# Altium project xxxxxx_PCB_Spectrum_Analyzer_x.PrjPcb
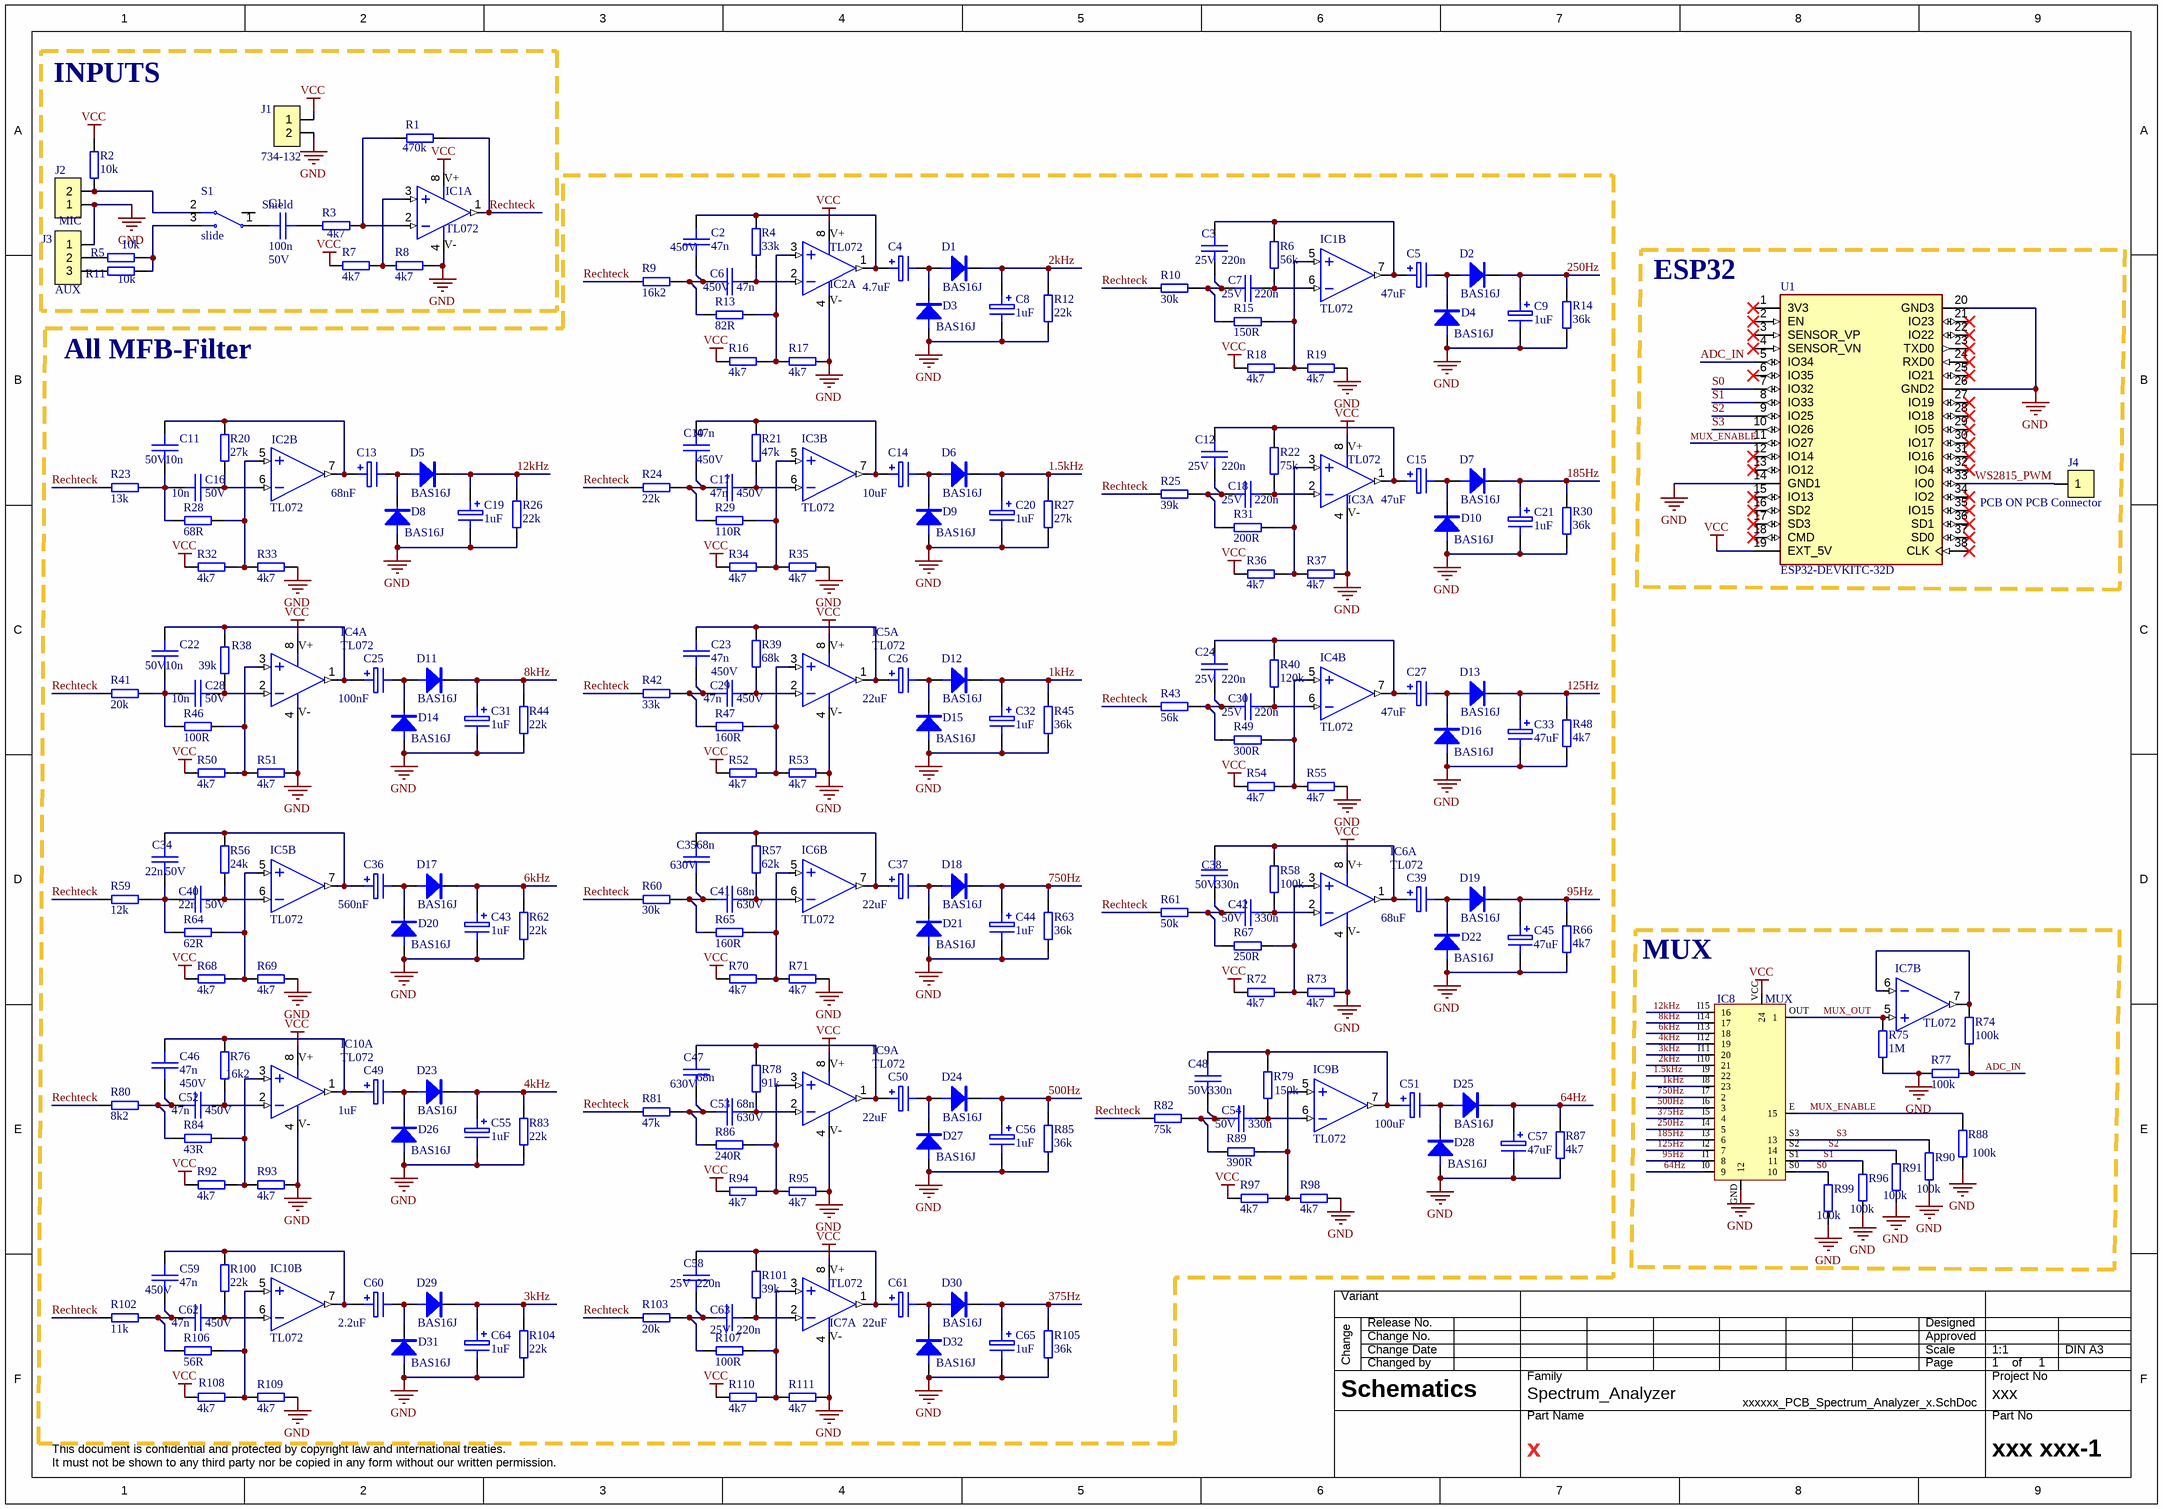
[diagram p0: xxxxxx_PCB_Spectrum_Analyzer_x.SchDoc]
a01PartNr1: xxx; a02PartNr2: xxx; a03Version: 1; a04Family: Spectrum_Analyzer; a05PartName: x; a06ProjectNumber: xxx; d01PanelTolerance: +/-0.100 mm; d02MaskMaterial: CrNi-Steel; d03MaskThickness: 100 um; d04MaskReduction: 10%; d05MaskTreatment: electro polished; d06FileName: xxxxxx_PCB_Spectrum_Analyzer_x; d07PanelName: xxxxxx_PCB_Spectrum_Analyzer_x_Panel; d08ThicknessTolerance: +/-10%
1 sheet, 224 parts. Net scope: global (net labels, ports and power ports of the same name join across sheets).
Board files: xxxxxx_PCB_Spectrum_Analyzer_x.PcbDoc, xxxxxx_PCB_Spectrum_Analyzer_x_Panel.PcbDoc

## Sheet xxxxxx_PCB_Spectrum_Analyzer_x.SchDoc
size 405 x 281 mm; SheetNumber: 1; SheetTotal: 1; CompanyName: CEDES AG

### Parts
C1  100n  U: 50V  [C_0805_B]
C2  47n  U: 450V  [C_0805_C]
C3  220n  U: 25V  [C_1206_C]
C4  4.7uF  [C 4.7uF]
C5  47uF  [C 4.7uF]
C6  47n  U: 450V  [C_0805_C]
C7  220n  U: 25V  [C_1206_C]
C8  1uF  [C 4.7uF]
C9  1uF  [C 4.7uF]
C10  47n  U: 450V  [C_0805_C]
C11  10n  U: 50V  [C_0805_B]
C12  220n  U: 25V  [C_1206_C]
C13  68nF  [C 4.7uF]
C14  10uF  [C 4.7uF]
C15  47uF  [C 4.7uF]
C16  10n  U: 50V  [C_0805_B]
C17  47n  U: 450V  [C_0805_C]
C18  220n  U: 25V  [C_1206_C]
C19  1uF  [C 4.7uF]
C20  1uF  [C 4.7uF]
C21  1uF  [C 4.7uF]
C22  10n  U: 50V  [C_0805_B]
C23  47n  U: 450V  [C_0805_C]
C24  220n  U: 25V  [C_1206_C]
C25  100nF  [C 4.7uF]
C26  22uF  [C 4.7uF]
C27  47uF  [C 4.7uF]
C28  10n  U: 50V  [C_0805_B]
C29  47n  U: 450V  [C_0805_C]
C30  220n  U: 25V  [C_1206_C]
C31  1uF  [C 4.7uF]
C32  1uF  [C 4.7uF]
C33  47uF  [C 4.7uF]
C34  22n  U: 50V  [C_0805_A]
C35  68n  U: 630V  [C_1210_D]
C36  560nF  [C 4.7uF]
C37  22uF  [C 4.7uF]
C38  330n  U: 50V  [C_1210_D]
C39  68uF  [C 4.7uF]
C40  22n  U: 50V  [C_0805_A]
C41  68n  U: 630V  [C_1210_D]
C42  330n  U: 50V  [C_1210_D]
C43  1uF  [C 4.7uF]
C44  1uF  [C 4.7uF]
C45  47uF  [C 4.7uF]
C46  47n  U: 450V  [C_0805_C]
C47  68n  U: 630V  [C_1210_D]
C48  330n  U: 50V  [C_1210_D]
C49  1uF  [C 4.7uF]
C50  22uF  [C 4.7uF]
C51  100uF  [C 4.7uF]
C52  47n  U: 450V  [C_0805_C]
C53  68n  U: 630V  [C_1210_D]
C54  330n  U: 50V  [C_1210_D]
C55  1uF  [C 4.7uF]
C56  1uF  [C 4.7uF]
C57  47uF  [C 4.7uF]
C58  220n  U: 25V  [C_1206_C]
C59  47n  U: 450V  [C_0805_C]
C60  2.2uF  [C 4.7uF]
C61  22uF  [C 4.7uF]
C62  47n  U: 450V  [C_0805_C]
C63  220n  U: 25V  [C_1206_C]
C64  1uF  [C 4.7uF]
C65  1uF  [C 4.7uF]
D1  Part: BAS16J  [SOD323F]
D2  Part: BAS16J  [SOD323F]
D3  Part: BAS16J  [SOD323F]
D4  Part: BAS16J  [SOD323F]
D5  Part: BAS16J  [SOD323F]
D6  Part: BAS16J  [SOD323F]
D7  Part: BAS16J  [SOD323F]
D8  Part: BAS16J  [SOD323F]
D9  Part: BAS16J  [SOD323F]
D10  Part: BAS16J  [SOD323F]
D11  Part: BAS16J  [SOD323F]
D12  Part: BAS16J  [SOD323F]
D13  Part: BAS16J  [SOD323F]
D14  Part: BAS16J  [SOD323F]
D15  Part: BAS16J  [SOD323F]
D16  Part: BAS16J  [SOD323F]
D17  Part: BAS16J  [SOD323F]
D18  Part: BAS16J  [SOD323F]
D19  Part: BAS16J  [SOD323F]
D20  Part: BAS16J  [SOD323F]
D21  Part: BAS16J  [SOD323F]
D22  Part: BAS16J  [SOD323F]
D23  Part: BAS16J  [SOD323F]
D24  Part: BAS16J  [SOD323F]
D25  Part: BAS16J  [SOD323F]
D26  Part: BAS16J  [SOD323F]
D27  Part: BAS16J  [SOD323F]
D28  Part: BAS16J  [SOD323F]
D29  Part: BAS16J  [SOD323F]
D30  Part: BAS16J  [SOD323F]
D31  Part: BAS16J  [SOD323F]
D32  Part: BAS16J  [SOD323F]
IC1  TL072  [SO8_A]  (parts A,B of 2)
IC2  TL072  [SO8_A]  (parts A,B of 2)
IC3  TL072  [SO8_A]  (parts A,B of 2)
IC4  TL072  [SO8_A]  (parts A,B of 2)
IC5  TL072  [SO8_A]  (parts A,B of 2)
IC6  TL072  [SO8_A]  (parts A,B of 2)
IC7  TL072  [SO8_A]  (parts A,B of 2)
IC8  MUX  [MUX]
IC9  TL072  [SO8_A]  (parts A,B of 2)
IC10  TL072  [SO8_A]  (parts A,B of 2)
J1  734-132  [734-132]
J2  MIC  [734-132]
J3  AUX  [734-133]
J4  PCB ON PCB Connector  [PCBConnectorPad]
R1  470k  [R_0805_A]
R2  10k  [R_0805_A]
R3  4k7  [R_0805_A]
R4  33k  [R_0805_A]
R5  10k  [R_0805_A]
R6  56k  [R_0805_A]
R7  4k7  [R_0805_A]
R8  4k7  [R_0805_A]
R9  16k2  [R_0805_A]
R10  30k  [R_0805_A]
R11  10k  [R_0805_A]
R12  22k  [R_0805_A]
R13  82R  [R_0805_A]
R14  36k  [R_0805_A]
R15  150R  [R_0805_A]
R16  4k7  [R_0805_A]
R17  4k7  [R_0805_A]
R18  4k7  [R_0805_A]
R19  4k7  [R_0805_A]
R20  27k  [R_0805_A]
R21  47k  [R_0805_A]
R22  75k  [R_0805_A]
R23  13k  [R_0402_A]
R24  22k  [R_0805_A]
R25  39k  [R_0805_A]
R26  22k  [R_0805_A]
R27  27k  [R_0805_A]
R28  68R  [R_0805_A]
R29  110R  [R_0805_A]
R30  36k  [R_0805_A]
R31  200R  [R_0805_A]
R32  4k7  [R_0805_A]
R33  4k7  [R_0805_A]
R34  4k7  [R_0805_A]
R35  4k7  [R_0805_A]
R36  4k7  [R_0805_A]
R37  4k7  [R_0805_A]
R38  39k  [R_0805_A]
R39  68k  [R_0805_A]
R40  120k  [R_0805_A]
R41  20k  [R_0805_A]
R42  33k  [R_0805_A]
R43  56k  [R_0805_A]
R44  22k  [R_0805_A]
R45  36k  [R_0805_A]
R46  100R  [R_0805_A]
R47  160R  [R_0805_A]
R48  4k7  [R_0805_A]
R49  300R  [R_0805_A]
R50  4k7  [R_0805_A]
R51  4k7  [R_0805_A]
R52  4k7  [R_0805_A]
R53  4k7  [R_0805_A]
R54  4k7  [R_0805_A]
R55  4k7  [R_0805_A]
R56  24k  [R_0805_A]
R57  62k  [R_0805_A]
R58  100k  [R_0805_A]
R59  12k  [R_0805_A]
R60  30k  [R_0805_A]
R61  50k  [R_0805_A]
R62  22k  [R_0805_A]
R63  36k  [R_0805_A]
R64  62R  [R_0805_A]
R65  160R  [R_0805_A]
R66  4k7  [R_0805_A]
R67  250R  [R_0805_A]
R68  4k7  [R_0805_A]
R69  4k7  [R_0805_A]
R70  4k7  [R_0805_A]
R71  4k7  [R_0805_A]
R72  4k7  [R_0805_A]
R73  4k7  [R_0805_A]
R74  100k  [R_0805_A]
R75  1M  [R_0805_A]
R76  16k2  [R_0805_A]
R77  100k  [R_0805_A]
R78  91k  [R_0805_A]
R79  150k  [R_0805_A]
R80  8k2  [R_0805_A]
R81  47k  [R_0805_A]
R82  75k  [R_0805_A]
R83  22k  [R_0805_A]
R84  43R  [R_0805_A]
R85  36k  [R_0805_A]
R86  240R  [R_0805_A]
R87  4k7  [R_0805_A]
R88  100k  [R_0805_A]
R89  390R  [R_0805_A]
R90  100k  [R_0805_A]
R91  100k  [R_0805_A]
R92  4k7  [R_0805_A]
R93  4k7  [R_0805_A]
R94  4k7  [R_0805_A]
R95  4k7  [R_0805_A]
R96  100k  [R_0805_A]
R97  4k7  [R_0805_A]
R98  4k7  [R_0805_A]
R99  100k  [R_0805_A]
R100  22k  [R_0805_A]
R101  39k  [R_0805_A]
R102  11k  [R_0805_A]
R103  20k  [R_0805_A]
R104  22k  [R_0805_A]
R105  36k  [R_0805_A]
R106  56R  [R_0805_A]
R107  100R  [R_0805_A]
R108  4k7  [R_0805_A]
R109  4k7  [R_0805_A]
R110  4k7  [R_0805_A]
R111  4k7  [R_0805_A]
S1  slide  [MSS3]
U1  ESP32-DEVKITC-32D  [MODULE_ESP32-DEVKITC-32D]

### Blocks framed on the sheet
INPUTS: C1 IC1 J1-J3 R1-R3 R5 R7 R8 R11 S1
All MFB-Filter: C2-C65 D1-D32 IC1-IC7 IC9 IC10 R4 R6 R9 R10 R12-R73 R76 R78-R87 R89 R92-R95 R97 R98 R100-R111
ESP32: J4 U1
MUX: IC7 IC8 R74 R75 R77 R88 R90 R91 R96 R99

### Nets
GND: C8.2 C9.2 C19.2 C20.2 C21.2 C31.2 C32.2 C33.2 C43.2 C44.2 C45.2 C55.2 C56.2 C57.2 C64.2 C65.2 D3.2(A) D4.2(A) D8.2(A) D9.2(A) D10.2(A) D14.2(A) D15.2(A) D16.2(A) D20.2(A) D21.2(A) D22.2(A) D26.2(A) D27.2(A) D28.2(A) D31.2(A) D32.2(A) IC1.4(V-) IC2.4(V-) IC3.4(V-) IC4.4(V-) IC5.4(V-) IC6.4(V-) IC7.4(V-) IC8.GND(12) IC9.4(V-) IC10.4(V-) J1.2 J2.1 J3.1 R8.2 R12.1 R14.1 R17.2 R19.2 R26.1 R27.1 R30.1 R33.2 R35.2 R37.2 R44.1 R45.1 R48.1 R51.2 R53.2 R55.2 R62.1 R63.1 R66.1 R69.2 R71.2 R73.2 R75.2 R77.2 R83.1 R85.1 R87.1 R88.1 R90.1 R91.1 R93.2 R95.2 R96.1 R98.2 R99.1 R104.1 R105.1 R109.2 R111.2 U1.14(GND1) U1.20(GND3) U1.26(GND2)
VCC: IC1.8(V+) IC2.8(V+) IC3.8(V+) IC4.8(V+) IC5.8(V+) IC6.8(V+) IC7.8(V+) IC8.VCC(24) IC9.8(V+) IC10.8(V+) J1.1 R2.2 R7.1 R16.1 R18.1 R32.1 R34.1 R36.1 R50.1 R52.1 R54.1 R68.1 R70.1 R72.1 R92.1 R94.1 R97.1 R108.1 R110.1 U1.19(EXT_5V)
1.5kHz: C20.1 D6.1(K) IC8.I9(22) R27.2
1kHz: C32.1 D12.1(K) IC8.I8(23) R45.2
2kHz: C8.1 D1.1(K) IC8.I10(21) R12.2
3kHz: C64.1 D29.1(K) IC8.I11(20) R104.2
4kHz: C55.1 D23.1(K) IC8.I12(19) R83.2
6kHz: C43.1 D17.1(K) IC8.I13(18) R62.2
8kHz: C31.1 D11.1(K) IC8.I14(17) R44.2
12kHz: C19.1 D5.1(K) IC8.I15(16) R26.2
64Hz: C57.1 D25.1(K) IC8.I0(9) R87.2
95Hz: C45.1 D19.1(K) IC8.I1(8) R66.2
125Hz: C33.1 D13.1(K) IC8.I2(7) R48.2
185Hz: C21.1 D7.1(K) IC8.I3(6) R30.2
250Hz: C9.1 D2.1(K) IC8.I4(5) R14.2
375Hz: C65.1 D30.1(K) IC8.I5(4) R105.2
500Hz: C56.1 D24.1(K) IC8.I6(3) R85.2
750Hz: C44.1 D18.1(K) IC8.I7(2) R63.2
ADC_IN: R74.2 R77.1 U1.5(IO34)
MUX_ENABLE: IC8.E(15) R88.2 U1.11(IO27)
MUX_OUT: IC7.5(B+) IC8.OUT(1) R75.1
Rechteck: IC1.1(Aout) R1.2 R9.2 R10.1 R23.2 R24.1 R25.1 R41.1 R42.1 R43.1 R59.1 R60.1 R61.1 R80.1 R81.1 R82.1 R102.1 R103.1
S0: IC8.S0(10) R99.2 U1.7(IO32)
S1: IC8.S1(11) R96.2 U1.8(IO33)
S2: IC8.S2(14) R91.2 U1.9(IO25)
S3: IC8.S3(13) R90.2 U1.10(IO26)
WS2815_PWM: J4.1 U1.33(IO0)
NetC1_1: C1.1 S1.1(A)
NetC1_2: C1.2 R3.1
NetC2_1: C2.1 C6.1 R9.1 R13.2
NetC2_2: C2.2 C4.1 IC2.1(Aout) R4.2
NetC3_1: C3.1 C7.1 R10.2 R15.1
NetC3_2: C3.2 C5.1 IC1.7(Bout) R6.2
NetC4_2: C4.2 D1.2(A) D3.1(K)
NetC5_2: C5.2 D2.2(A) D4.1(K)
NetC6_2: C6.2 IC2.2(A-) R4.1
NetC7_2: C7.2 IC1.6(B-) R6.1
NetC10_1: C10.1 C17.1 R24.2 R29.1
NetC10_2: C10.2 C14.1 IC3.7(Bout) R21.2
NetC11_1: C11.1 C16.1 R23.1 R28.1
NetC11_2: C11.2 C13.1 IC2.7(Bout) R20.2
NetC12_1: C12.1 C18.1 R25.2 R31.1
NetC12_2: C12.2 C15.1 IC3.1(Aout) R22.2
NetC13_2: C13.2 D5.2(A) D8.1(K)
NetC14_2: C14.2 D6.2(A) D9.1(K)
NetC15_2: C15.2 D7.2(A) D10.1(K)
NetC16_2: C16.2 IC2.6(B-) R20.1
NetC17_2: C17.2 IC3.6(B-) R21.1
NetC18_2: C18.2 IC3.2(A-) R22.1
NetC22_1: C22.1 C28.1 R41.2 R46.1
NetC22_2: C22.2 C25.1 IC4.1(Aout) R38.1
NetC23_1: C23.1 C29.1 R42.2 R47.1
NetC23_2: C23.2 C26.1 IC5.1(Aout) R39.2
NetC24_1: C24.1 C30.1 R43.2 R49.1
NetC24_2: C24.2 C27.1 IC4.7(Bout) R40.2
NetC25_2: C25.2 D11.2(A) D14.1(K)
NetC26_2: C26.2 D12.2(A) D15.1(K)
NetC27_2: C27.2 D13.2(A) D16.1(K)
NetC28_2: C28.2 IC4.2(A-) R38.2
NetC29_2: C29.2 IC5.2(A-) R39.1
NetC30_2: C30.2 IC4.6(B-) R40.1
NetC34_1: C34.1 C40.1 R59.2 R64.1
NetC34_2: C34.2 C36.1 IC5.7(Bout) R56.2
NetC35_1: C35.1 C41.1 R60.2 R65.1
NetC35_2: C35.2 C37.1 IC6.7(Bout) R57.2
NetC36_2: C36.2 D17.2(A) D20.1(K)
NetC37_2: C37.2 D18.2(A) D21.1(K)
NetC38_1: C38.1 C42.1 R61.2 R67.1
NetC38_2: C38.2 C39.1 IC6.1(Aout) R58.2
NetC39_2: C39.2 D19.2(A) D22.1(K)
NetC40_2: C40.2 IC5.6(B-) R56.1
NetC41_2: C41.2 IC6.6(B-) R57.1
NetC42_2: C42.2 IC6.2(A-) R58.1
NetC46_1: C46.1 C52.1 R80.2 R84.1
NetC46_2: C46.2 C49.1 IC10.1(Aout) R76.2
NetC47_1: C47.1 C53.1 R81.2 R86.1
NetC47_2: C47.2 C50.1 IC9.1(Aout) R78.2
NetC48_1: C48.1 C54.1 R82.2 R89.1
NetC48_2: C48.2 C51.1 IC9.7(Bout) R79.2
NetC49_2: C49.2 D23.2(A) D26.1(K)
NetC50_2: C50.2 D24.2(A) D27.1(K)
NetC51_2: C51.2 D25.2(A) D28.1(K)
NetC52_2: C52.2 IC10.2(A-) R76.1
NetC53_2: C53.2 IC9.2(A-) R78.1
NetC54_2: C54.2 IC9.6(B-) R79.1
NetC58_1: C58.1 C63.1 R103.2 R107.1
NetC58_2: C58.2 C61.1 IC7.1(Aout) R101.2
NetC59_1: C59.1 C62.1 R102.2 R106.1
NetC59_2: C59.2 C60.1 IC10.7(Bout) R100.2
NetC60_2: C60.2 D29.2(A) D31.1(K)
NetC61_2: C61.2 D30.2(A) D32.1(K)
NetC62_2: C62.2 IC10.6(B-) R100.1
NetC63_2: C63.2 IC7.2(A-) R101.1
NetIC1_2: IC1.2(A-) R1.1 R3.2
NetIC1_3: IC1.3(A+) R7.2 R8.1
NetIC1_5: IC1.5(B+) R15.2 R18.2 R19.1
NetIC2_3: IC2.3(A+) R13.1 R16.2 R17.1
NetIC2_5: IC2.5(B+) R28.2 R32.2 R33.1
NetIC3_3: IC3.3(A+) R31.2 R36.2 R37.1
NetIC3_5: IC3.5(B+) R29.2 R34.2 R35.1
NetIC4_3: IC4.3(A+) R46.2 R50.2 R51.1
NetIC4_5: IC4.5(B+) R49.2 R54.2 R55.1
NetIC5_3: IC5.3(A+) R47.2 R52.2 R53.1
NetIC5_5: IC5.5(B+) R64.2 R68.2 R69.1
NetIC6_3: IC6.3(A+) R67.2 R72.2 R73.1
NetIC6_5: IC6.5(B+) R65.2 R70.2 R71.1
NetIC7_3: IC7.3(A+) R107.2 R110.2 R111.1
NetIC7_6: IC7.6(B-) IC7.7(Bout) R74.1
NetIC9_3: IC9.3(A+) R86.2 R94.2 R95.1
NetIC9_5: IC9.5(B+) R89.2 R97.2 R98.1
NetIC10_3: IC10.3(A+) R84.2 R92.2 R93.1
NetIC10_5: IC10.5(B+) R106.2 R108.2 R109.1
NetJ2_2: J2.2 R2.1 S1.2(C)
NetJ3_2: J3.2 R5.2
NetJ3_3: J3.3 R11.2
NetR5_1: R5.1 R11.1 S1.3(A)

Not connected (* = marked no-connect by the designer): S1 Shield; U1 1(3V3)* 2(EN)* 3(SENSOR_VP)* 4(SENSOR_VN)* 6(IO35)* 12(IO14)* 13(IO12)* 15(IO13)* 16(SD2)* 17(SD3)* 18(CMD)* 21(IO23)* 22(IO22)* 23(TXD0)* 24(RXD0)* 25(IO21)* 27(IO19)* 28(IO18)* 29(IO5)* 30(IO17)* 31(IO16)* 32(IO4)* 34(IO2)* 35(IO15)* 36(SD1)* 37(SD0)* 38(CLK)*

### Notes on the sheet
- Variant
- Release No.
- Designed
- Change
- Change No.
- Changed by
- Change Date
- Family
- Approved
- Page
- Scale
- 1:1
- Project No
- of
- DIN A3
- This document is confidential and protected by copyright law and international treaties.
- Schematics
- Part Name
- Part No
- It must not be shown to any third party nor be copied in any form without our written permission.

### Library data of the parts
C1 = 301 143: C 100n 10% 50V X7R 0805; Part Number: 301 143; %: 10; Signal Integrity: Cap; Imax: x; C2: 1; C3: 4; Ea1: 0.35; Tref: 40; State: active; Assembly: SMD; UrefUmax: 0.5; VALUE: 100n; Umax: 50V; Component Type: Capacitor; ComponentLink1Description: Datasheet; ComponentLink1URL: \\vm-pizol\DATEN\Fabdaten\3xx xxx\30x xxx\301 xxx\301 1xx\301143_C_100nF_10%_50V_X7R_0805; Footprint: 0805; Pin Count: 2; Published: 08.01.2016; Publisher: RKE; Ieff: x; Ueff: *; Teff: *; C1: x; A: 1; Ea2: x; Failure rate: 2; Cost: 0.007200; Pmax: x; IrefImax: x
C2 C6 C10 C17 C23 C29 C46 C52 C59 C62 = 302 687: C 47n 10% 450V X7T 0805; Part Number: 302 687; %: 10; Signal Integrity: Cap; Imax: x; C2: 1; C3: 4; Ea1: 0.35; Tref: 40; State: active; Assembly: SMD; UrefUmax: 0.5; VALUE: 47n; Umax: 450V; Component Type: Capacitor; ComponentLink1Description: Datasheet; ComponentLink1URL: \\vm-pizol\DATEN\Fabdaten\3xx xxx\30x xxx\302 xxx\302 6xx\302687; Footprint: 0805; Pin Count: 2; Published: 08.01.2016; Publisher: RKE; Ieff: x; Ueff: *; Teff: *; C1: x; A: 1; Ea2: x; Failure rate: 2; Cost: 0.058200; Pmax: x; IrefImax: x
C3 C7 C12 C18 C24 C30 C58 C63 = 301 734: C 220n 20% 25V X7R 1206; Part Number: 301 734; %: 20; Signal Integrity: Cap; Imax: x; C2: 1; C3: 4; Ea1: 0.35; Tref: 40; State: active; Assembly: SMD; UrefUmax: 0.5; VALUE: 220n; Umax: 25V; Component Type: Capacitor; ComponentLink1Description: Datasheet; ComponentLink1URL: \\vm-pizol\DATEN\Fabdaten\3xx xxx\30x xxx\301 xxx\301 7xx\301734_C_220nF_20%_25V_X7R_1206; Footprint: 1206; Pin Count: 2; Published: 08.01.2016; Publisher: RKE; Ieff: x; Ueff: *; Teff: *; C1: x; A: 1; Ea2: x; Failure rate: 2; Cost: 0.009500; Pmax: x; IrefImax: x
C4 C5 C8 C9 C13-C15 C19-C21 C25-C27 C31-C33 C36 C37 C39 C43-C45 C49-C51 C55-C57 C60 C61 C64 C65 = C 4.7uF 450V
C11 C16 C22 C28 = 300 130: C 10n 10% 50V X7R 0805; Part Number: 300 130; %: 10; Signal Integrity: Cap; Imax: x; C2: 1; C3: 4; Ea1: 0.35; Tref: 40; State: active; Assembly: SMD; UrefUmax: 0.5; VALUE: 10n; Umax: 50V; Component Type: Capacitor; ComponentLink1Description: Datasheet; ComponentLink1URL: \\vm-pizol\DATEN\Fabdaten\3xx xxx\30x xxx\300 xxx\300 1xx\300130_C_10nF_10%_50V_X7R_0805; Footprint: 0805; Pin Count: 2; Published: 08.01.2016; Publisher: RKE; Ieff: x; Ueff: *; Teff: *; C1: x; A: 1; Ea2: x; Failure rate: 2; Cost: 0.006800; Pmax: x; IrefImax: x
C34 C40 = 300 131: C 22n 10% 50V X7R 0805; Part Number: 300 131; %: 10; Signal Integrity: Cap; Imax: x; C2: 1; C3: 4; Ea1: 0.35; Tref: 40; State: active; Assembly: SMD; UrefUmax: 0.5; VALUE: 22n; Umax: 50V; Component Type: Capacitor; ComponentLink1Description: Datasheet; ComponentLink1URL: \\vm-pizol\DATEN\Fabdaten\3xx xxx\30x xxx\300 xxx\300 1xx\300131_C_22nF_10%_50V_X7R_0805; Footprint: 0805; Pin Count: 2; Published: 08.01.2016; Publisher: RKE; Ieff: x; Ueff: *; Teff: *; C1: x; A: 1; Ea2: x; Failure rate: 2; Cost: 0.005100; Pmax: x; IrefImax: x
C35 C41 C47 C53 = 302 807: C 68n 20% 630V X7R 1210; Part Number: 302 807; %: 20; Signal Integrity: Cap; Imax: x; C2: 1; C3: 4; Ea1: 0.35; Tref: 40; State: active; Assembly: SMD; UrefUmax: 0.5; VALUE: 68n; LatestRevisionDate: 29.06.2016/RKE; Umax: 630V; Component Type: Capacitor; ComponentLink1Description: Datasheet; ComponentLink1URL: \\vm-pizol\DATEN\Fabdaten\3xx xxx\30x xxx\302 xxx\302 8xx\302807; Footprint: 1210; Pin Count: 2; Published: 08.01.2016; Publisher: RKE; Ieff: x; Ueff: *; Teff: *; C1: x; A: 1; Ea2: x; Failure rate: 2; Cost: 0.212700; Pmax: x; IrefImax: x
C38 C42 C48 C54 = 300 462: C 330n 50V X7R 1210; Part Number: 300 462; %: 10; Signal Integrity: Cap; Imax: x; C2: 1; C3: 4; Ea1: 0.35; Tref: 40; State: active; Assembly: SMD; UrefUmax: 0.5; VALUE: 330n; LatestRevisionDate: 29.06.2016/RKE; Umax: 50V; Component Type: Capacitor; ComponentLink1Description: Datasheet; ComponentLink1URL: \\vm-pizol\DATEN\Fabdaten\3xx xxx\30x xxx\300 xxx\300 4xx\300462_C_330nF_-20-+80_50V_Y5V_1210; Footprint: 1210; Pin Count: 2; Published: 08.01.2016; Publisher: RKE; Ieff: x; Ueff: *; Teff: *; C1: x; A: 1; Ea2: x; Failure rate: 2; Cost: 0.041000; Pmax: x; IrefImax: x
D1-D32 = 303 357: D BAS16J 250mA/100V SOD323F; Part Number: 303 357; VALUE: 100V/250mA; State: active; Assembly: SMD; %: *; Component Type: Diode; ComponentLink1Description: Datasheet; ComponentLink1URL: \\vm-pizol\DATEN\Fabdaten\3xx xxx\30x xxx\303 xxx\303 3xx\303357; LatestRevisionDate: *; LatestRevisionNote: *; Pin Count: 2; Published: 22.10.2018; Publisher: MFL; Signal Integrity: *; Simulation: *; Simulation Kind: *; Cost: 0.011000; Umax: *; Imax: *; Ieff: *; Ueff: *; Teff: *; SW Count: *; C1: *; C2: *; C3: *; C4: *; C5: *; A: *; Ea1: *; Ea2: *; Failure rate: *; Tref: *; Uref: *; Pmax: *; UrefUmax: *; IrefImax: *; MannufacturerPartNumber: BAS16J
IC1-IC7 IC9 IC10 = 300 454: IC TL072 OpAmp -40°..+85°C SO8; Part Number: 300 454; State: active; Assembly: SMD; Value: TL072; Component Type: Integrated circuit; ComponentLink1Description: Datasheet; ComponentLink1URL: \\vm-pizol\DATEN\Fabdaten\3xx xxx\30x xxx\300 xxx\300 4xx\300454_IC_TL072_-40°_+85°C_SO8; Footprint: SO8; LatestRevisionDate: 31.10.2019 / MFL; LatestRevisionNote: Change 3D-Body; Pin Count: 8; Published: 25.10.2016; Publisher: RKE; Signal Integrity: *; Simulation: *; Simulation Kind: *; Cost: 0.141300; Umax: *; Imax: *; Ieff: *; Ueff: *; Teff: *; SW Count: *; C1: *; C2: *; C3: *; C4: *; C5: *; A: *; Ea1: *; Ea2: *; Failure rate: *; Tref: *; Uref: *
IC8 = MUX: Analog MUX 16-Bit; pin to pad: E>15 GND>12 I0>9 I1>8 I2>7 I3>6 I4>5 I5>4 I6>3 I7>2 I8>23 I9>22 I10>21 I11>20 I12>19 I13>18 I14>17 I15>16 OUT>1 S0>10 S1>11 S2>14 S3>13 VCC>24
J1 = 301 939: J Header m 0° 2p 3.5mm; Part Number: 301 939; State: active; Assembly: THT; Value: 734-132; %: *; Component Type: Connector; ComponentLink1Description: Datasheet; ComponentLink1URL: \\CHKANSFS0011\DATEN\Fabdaten\3xx xxx\30x xxx\301 xxx\301 9xx\301939_J_Messerleiste_Print_2-pol._3.5mm_gerade_WAGO; LatestRevisionDate: *; LatestRevisionNote: *; Pin Count: 2; Published: 20.06.2019; Publisher: MFL; Signal Integrity: *; Simulation: *; Simulation Kind: *; Cost: 0.120200; Umax: *; Imax: *; Ieff: *; Ueff: *; Teff: *; SW Count: *; C1: *; C2: *; C3: *; C4: *; C5: *; A: *; Ea1: *; Ea2: *; Failure rate: *; Tref: *; Uref: *; Pmax: *
J2 = 301 939: J Header m 0° 2p 3.5mm; Part Number: 301 939; Value: 734-132; State: active; Assembly: THT; %: *; Component Type: Connector; ComponentLink1Description: Datasheet; ComponentLink1URL: \\CHKANSFS0011\DATEN\Fabdaten\3xx xxx\30x xxx\301 xxx\301 9xx\301939_J_Messerleiste_Print_2-pol._3.5mm_gerade_WAGO; LatestRevisionDate: *; LatestRevisionNote: *; Pin Count: 2; Published: 20.06.2019; Publisher: MFL; Signal Integrity: *; Simulation: *; Simulation Kind: *; Cost: 0.120200; Umax: *; Imax: *; Ieff: *; Ueff: *; Teff: *; SW Count: *; C1: *; C2: *; C3: *; C4: *; C5: *; A: *; Ea1: *; Ea2: *; Failure rate: *; Tref: *; Uref: *; Pmax: *
J3 = 301 940: J Header m 0° 3p 3.5mm; Part Number: 301 940; Value: 734-133; State: active; Assembly: THT; %: *; Component Type: Connector; ComponentLink1Description: Datasheet; ComponentLink1URL: \\CHKANSFS0011\DATEN\Fabdaten\3xx xxx\30x xxx\301 xxx\301 9xx\301940_J_Messerleiste_Print_3-pol._3.5mm_gerade_WAGO; ComponentLink2Description: *; ComponentLink2URL: *; LatestRevisionDate: *; LatestRevisionNote: *; Pin Count: 3; Published: 20.05.2019; Publisher: MFL; Signal Integrity: *; Simulation: *; Simulation Kind: *; Cost: 0.189300; Umax: *; Imax: *; Ieff: *; Ueff: *; Teff: *; SW Count: *; C1: *; C2: *; C3: *; C4: *; C5: *; A: *; Ea1: *; Ea2: *; Failure rate: *; Tref: *; Uref: *; Pmax: *
J4 = PCB ON PCB Connector: %: PcbLibraries\KONV.PcbLib; Assembly: x; Value: PCB ON PCB Connector; Published: 15.05.2017; Publisher: RKE; Component Type: Pads; Pin Count: 1
R1 = 300 093: R 560k 5% 125mW 0805; Part Number: 300 093; %: 5; Imax: x; A: 0.87; Ea1: 0.16; Ea2: 0.44; Tref: 55; Pmax: 0.125; State: running out; Assembly: SMD; VALUE: 560k; Component Type: Resistor; ComponentLink1Description: Datasheet; ComponentLink1URL: \\vm-pizol\DATEN\Fabdaten\3xx xxx\30x xxx\300 xxx\300 0xx\300093_R_560K_5%_125mW_0805; Footprint: 0805; Pin Count: 2; Published: 28.04.2016; Publisher: MFL; Signal Integrity: Resistor; Cost: 0.002000; Umax: *; Ieff: x; Ueff: x; Teff: *; SW Count: x; C1: x; C2: x; C3: x; C4: x; C5: x; Failure rate: 0.2; Uref: x; UrefUmax: x; IrefImax: x
R2 R3 R5 R7 R8 R11 R16-R19 R32-R37 R50-R55 R68-R73 R92-R95 R97 R98 R108-R111 = 300 079: R 4k7 1% 125mW 0805; Part Number: 300 079; %: 1; Imax: x; A: 0.87; Ea1: 0.16; Ea2: 0.44; Tref: 55; Pmax: 0.125; State: active; Assembly: SMD; VALUE: 4k7; Component Type: Resistor; ComponentLink1Description: Datasheet; ComponentLink1URL: \\vm-pizol\DATEN\Fabdaten\3xx xxx\30x xxx\300 xxx\300 0xx\300079_R_4K7_1%_125mW_0805; Footprint: 0805; Pin Count: 2; Published: 08.01.2016; Publisher: RKE; Signal Integrity: Resistor; Cost: 0.002000; Umax: *; Ieff: x; Ueff: x; Teff: *; SW Count: x; C1: x; C2: x; C3: x; C4: x; C5: x; Failure rate: 0.2; Uref: x; UrefUmax: x; IrefImax: x
R4 R10 R25 R42 R60 R101 = 300 435: R 33k 5% 125mW 0805; Part Number: 300 435; %: 5; Imax: x; A: 0.87; Ea1: 0.16; Ea2: 0.44; Tref: 55; Pmax: 0.125; State: active; Assembly: SMD; VALUE: 33k; Component Type: Resistor; ComponentLink1Description: Datasheet; ComponentLink1URL: \\vm-pizol\DATEN\Fabdaten\3xx xxx\30x xxx\300 xxx\300 4xx\300435_R_33K_5%_125mW_0805; Footprint: 0805; Pin Count: 2; Published: 28.04.2016; Publisher: MFL; Signal Integrity: Resistor; Cost: 0.002000; Umax: *; Ieff: x; Ueff: x; Teff: *; SW Count: x; C1: x; C2: x; C3: x; C4: x; C5: x; Failure rate: 0.2; Uref: x; UrefUmax: x; IrefImax: x
R6 = 302 780: R 56k 1% 125mW 0805; Part Number: 302 780; %: 1; Imax: x; A: 0.87; Ea1: 0.16; Ea2: 0.44; Tref: 55; Pmax: 0.125; State: active; Assembly: SMD; VALUE: 56k; Component Type: Resistor; ComponentLink1Description: Datasheet; ComponentLink1URL: \\vm-pizol\DATEN\Fabdaten\3xx xxx\30x xxx\302 xxx\302 7xx\302780; Footprint: 0805; Pin Count: 2; Published: 28.04.2016; Publisher: MFL; Signal Integrity: Resistor; Cost: 0.003200; Umax: *; Ieff: x; Ueff: x; Teff: *; SW Count: x; C1: x; C2: x; C3: x; C4: x; C5: x; Failure rate: 0.2; Uref: x; UrefUmax: x; IrefImax: x
R9 R76 = 300 849: R 15k 5% 125mW 0805; Part Number: 300 849; %: 5; Imax: x; A: 0.87; Ea1: 0.16; Ea2: 0.44; Tref: 55; Pmax: 0.125; State: active; Assembly: SMD; VALUE: 15k; Component Type: Resistor; ComponentLink1Description: Datasheet; ComponentLink1URL: \\vm-pizol\DATEN\Fabdaten\3xx xxx\30x xxx\300 xxx\300 8xx\300849_R_15K_5%_125mW_0805; Footprint: 0805; Pin Count: 2; Published: 28.04.2016; Publisher: MFL; Signal Integrity: Resistor; Cost: 0.002000; Umax: *; Ieff: x; Ueff: x; Teff: *; SW Count: x; C1: x; C2: x; C3: x; C4: x; C5: x; Failure rate: 0.2; Uref: x; UrefUmax: x; IrefImax: x
R12 R14 R20 R26 R27 R30 R44 R45 R48 R62 R63 R66 R74 R75 R77 R83 R85 R87 R88 R90 R91 R96 R99 R104 R105 = 300 083: R 27k 5% 125mW 0805; Part Number: 300 083; %: 5; Imax: x; A: 0.87; Ea1: 0.16; Ea2: 0.44; Tref: 55; Pmax: 0.125; State: active; Assembly: SMD; VALUE: 27k; Component Type: Resistor; ComponentLink1Description: Datasheet; ComponentLink1URL: \\vm-pizol\DATEN\Fabdaten\3xx xxx\30x xxx\300 xxx\300 0xx\300083_R_27K_5%_125mW_0805; Footprint: 0805; Pin Count: 2; Published: 27.04.2016; Publisher: MFL; Signal Integrity: Resistor; Cost: 0.002000; Umax: *; Ieff: x; Ueff: x; Teff: *; SW Count: x; C1: x; C2: x; C3: x; C4: x; C5: x; Failure rate: 0.2; Uref: x; UrefUmax: x; IrefImax: x
R13 R22 = 303 408: R 75R 1% 125mW 0805; Part Number: 303 408; %: 1; Imax: x; A: 0.87; Ea1: 0.16; Ea2: 0.44; Tref: 55; Pmax: 0.125; State: active; Assembly: SMD; VALUE: 75R; Component Type: Resistor; ComponentLink1Description: Datasheet; ComponentLink1URL: \\CHKANSFS0011\DATEN\Fabdaten\3xx xxx\30x xxx\303 xxx\303 4xx\303408; Footprint: 0805; Pin Count: 2; Published: 17.04.2019; Publisher: MFL; Signal Integrity: Resistor; Cost: 0.001900; Umax: *; Ieff: x; Ueff: x; Teff: *; SW Count: x; C1: x; C2: x; C3: x; C4: x; C5: x; Failure rate: 0.2; Uref: x; UrefUmax: x; IrefImax: x
R15 R47 R65 = 302 203: R 150R 5% 125mW 0805; Part Number: 302 203; %: 5; Imax: x; A: 0.87; Ea1: 0.16; Ea2: 0.44; Tref: 55; Pmax: 0.125; State: active; Assembly: SMD; VALUE: 150R; Component Type: Resistor; ComponentLink1Description: Datasheet; ComponentLink1URL: \\vm-pizol\DATEN\Fabdaten\3xx xxx\30x xxx\302 xxx\302 2xx\302203_R_150R_5%_125mW_ 0805; Footprint: 0805; Pin Count: 2; Published: 28.04.2016; Publisher: MFL; Signal Integrity: Resistor; Cost: 0.002000; Umax: *; Ieff: x; Ueff: x; Teff: *; SW Count: x; C1: x; C2: x; C3: x; C4: x; C5: x; Failure rate: 0.2; Uref: x; UrefUmax: x; IrefImax: x
R21 R81 = 300 084: R 47k 5% 125mW 0805; Part Number: 300 084; %: 5; Imax: x; A: 0.87; Ea1: 0.16; Ea2: 0.44; Tref: 55; Pmax: 0.125; State: active; Assembly: SMD; VALUE: 47k; Component Type: Resistor; ComponentLink1Description: Datasheet; ComponentLink1URL: \\vm-pizol\DATEN\Fabdaten\3xx xxx\30x xxx\300 xxx\300 0xx\300084_R_47K_5%_125mW_0805; Footprint: 0805; Pin Count: 2; Published: 28.04.2016; Publisher: MFL; Signal Integrity: Resistor; Cost: 0.001900; Umax: *; Ieff: x; Ueff: x; Teff: *; SW Count: x; C1: x; C2: x; C3: x; C4: x; C5: x; Failure rate: 0.2; Uref: x; UrefUmax: x; IrefImax: x
R23 = 303 285: R 13k 1% 63mW 0402; Part Number: 303 285; %: 1; Imax: x; A: 0.87; Ea1: 0.16; Ea2: 0.44; Tref: 55; Pmax: 0.063; State: active; Assembly: SMD; VALUE: 13k; Component Type: Resistor; ComponentLink1Description: Datasheet; ComponentLink1URL: \\vm-pizol\DATEN\Fabdaten\3xx xxx\30x xxx\303 xxx\303 2xx\303285; Footprint: 0402; Pin Count: 2; Published: 05.12.2017; Publisher: MFL; Signal Integrity: Resistor; Cost: 0.000600; Umax: *; Ieff: x; Ueff: x; Teff: *; SW Count: x; C1: x; C2: x; C3: x; C4: x; C5: x; Failure rate: 0.2; Uref: x; UrefUmax: x; IrefImax: x
R24 R56 R100 R103 = 300 082: R 22k 5% 125mW 0805; Part Number: 300 082; %: 5; Imax: x; A: 0.87; Ea1: 0.16; Ea2: 0.44; Tref: 55; Pmax: 0.125; State: active; Assembly: SMD; VALUE: 22k; Component Type: Resistor; ComponentLink1Description: Datasheet; ComponentLink1URL: \\vm-pizol\DATEN\Fabdaten\3xx xxx\30x xxx\300 xxx\300 0xx\300082_R_22K_5%_125mW_0805; Footprint: 0805; Pin Count: 2; Published: 27.04.2016; Publisher: MFL; Signal Integrity: Resistor; Cost: 0.001500; Umax: *; Ieff: x; Ueff: x; Teff: *; SW Count: x; C1: x; C2: x; C3: x; C4: x; C5: x; Failure rate: 0.2; Uref: x; UrefUmax: x; IrefImax: x
R28 R39 R57 = 300 086: R 68k 1% 125mW 0805; Part Number: 300 086; %: 1; Imax: x; A: 0.87; Ea1: 0.16; Ea2: 0.44; Tref: 55; Pmax: 0.125; State: active; Assembly: SMD; VALUE: 68k; Component Type: Resistor; ComponentLink1Description: Datasheet; ComponentLink1URL: \\vm-pizol\DATEN\Fabdaten\3xx xxx\30x xxx\300 xxx\300 0xx\300086_R_68K_5%_125mW_0805; Footprint: 0805; Pin Count: 2; Published: 28.04.2016; Publisher: MFL; Signal Integrity: Resistor; Cost: 0.001900; Umax: *; Ieff: x; Ueff: x; Teff: *; SW Count: x; C1: x; C2: x; C3: x; C4: x; C5: x; Failure rate: 0.2; Uref: x; UrefUmax: x; IrefImax: x
R29 R46 R107 = 300 069: R 100R 1% 125mW 0805; Part Number: 300 069; %: 1; Imax: x; A: 0.87; Ea1: 0.16; Ea2: 0.44; Tref: 55; Pmax: 0.125; State: active; Assembly: SMD; VALUE: 100R; Component Type: Resistor; ComponentLink1Description: Datasheet; ComponentLink1URL: \\vm-pizol\DATEN\Fabdaten\3xx xxx\30x xxx\300 xxx\300 0xx\300069_R_100R_5%_125mW_0805; Footprint: 0805; Pin Count: 2; Published: 01.03.2016; Publisher: RKE; Signal Integrity: Resistor; Cost: 0.001800; Umax: *; Ieff: x; Ueff: x; Teff: *; SW Count: x; C1: x; C2: x; C3: x; C4: x; C5: x; Failure rate: 0.2; Uref: x; UrefUmax: x; IrefImax: x
R31 R40 R43 R49 R58 R61 R67 R79 R82 R86 R89 = 300 917: R 220R 1% 125mW 0805; Part Number: 300 917; %: 5; Imax: x; A: 0.87; Ea1: 0.16; Ea2: 0.44; Tref: 55; Pmax: 0.125; State: active; Assembly: SMD; VALUE: 220R; LatestRevisionDate: 29.05.2018/MAG; LatestRevisionNote: From 5% to 1%; Component Type: Resistor; ComponentLink1Description: Datasheet; ComponentLink1URL: \\vm-pizol\DATEN\Fabdaten\3xx xxx\30x xxx\300 xxx\300 9xx\300917_R_220R_5%_125mW_0805; Footprint: 0805; Pin Count: 2; Published: 28.04.2016; Publisher: MFL; Signal Integrity: Resistor; Cost: 0.001900; Umax: *; Ieff: x; Ueff: x; Teff: *; SW Count: x; C1: x; C2: x; C3: x; C4: x; C5: x; Failure rate: 0.2; Uref: x; UrefUmax: x; IrefImax: x
R38 R59 = 300 081: R 12k 5% 125mW 0805; Part Number: 300 081; %: 5; Imax: x; A: 0.87; Ea1: 0.16; Ea2: 0.44; Tref: 55; Pmax: 0.125; State: active; Assembly: SMD; VALUE: 12k; Component Type: Resistor; ComponentLink1Description: Datasheet; ComponentLink1URL: \\vm-pizol\DATEN\Fabdaten\3xx xxx\30x xxx\300 xxx\300 0xx\300081_R_12K_5%_125mW_0805; Footprint: 0805; Pin Count: 2; Published: 27.04.2016; Publisher: MFL; Signal Integrity: Resistor; Cost: 0.001900; Umax: *; Ieff: x; Ueff: x; Teff: *; SW Count: x; C1: x; C2: x; C3: x; C4: x; C5: x; Failure rate: 0.2; Uref: x; UrefUmax: x; IrefImax: x
R41 = 300 080: R 20k 1% 125mW 0805; Part Number: 300 080; VALUE: 10k; %: 1; Imax: x; A: 0.87; Ea1: 0.16; Ea2: 0.44; Tref: 55; Pmax: 0.125; State: active; Assembly: SMD; Component Type: Resistor; ComponentLink1Description: Datasheet; ComponentLink1URL: \\vm-pizol\DATEN\Fabdaten\3xx xxx\30x xxx\300 xxx\300 0xx\300080_R_10K_1%_125mW_0805; Footprint: 0805; Pin Count: 2; Published: 27.04.2016; Publisher: MFL; Signal Integrity: Resistor; Cost: 0.002000; Umax: *; Ieff: x; Ueff: x; Teff: *; SW Count: x; C1: x; C2: x; C3: x; C4: x; C5: x; Failure rate: 0.2; Uref: x; UrefUmax: x; IrefImax: x
R64 = 300 086: R 62R 1% 125mW 0805; Part Number: 300 086; VALUE: 68k; %: 1; Imax: x; A: 0.87; Ea1: 0.16; Ea2: 0.44; Tref: 55; Pmax: 0.125; State: active; Assembly: SMD; Component Type: Resistor; ComponentLink1Description: Datasheet; ComponentLink1URL: \\vm-pizol\DATEN\Fabdaten\3xx xxx\30x xxx\300 xxx\300 0xx\300086_R_68K_5%_125mW_0805; Footprint: 0805; Pin Count: 2; Published: 28.04.2016; Publisher: MFL; Signal Integrity: Resistor; Cost: 0.001900; Umax: *; Ieff: x; Ueff: x; Teff: *; SW Count: x; C1: x; C2: x; C3: x; C4: x; C5: x; Failure rate: 0.2; Uref: x; UrefUmax: x; IrefImax: x
R78 = 300 087: R 100k 5% 125mW 0805; Part Number: 300 087; %: 5; Imax: x; A: 0.87; Ea1: 0.16; Ea2: 0.44; Tref: 55; Pmax: 0.125; State: active; Assembly: SMD; VALUE: 100k; Component Type: Resistor; ComponentLink1Description: Datasheet; ComponentLink1URL: \\vm-pizol\DATEN\Fabdaten\3xx xxx\30x xxx\300 xxx\300 0xx\300087_R_100K_5%_125mW_0805; Footprint: 0805; Pin Count: 2; Published: 08.01.2016; Publisher: RKE; Signal Integrity: Resistor; Cost: 0.002000; Umax: *; Ieff: x; Ueff: x; Teff: *; SW Count: x; C1: x; C2: x; C3: x; C4: x; C5: x; Failure rate: 0.2; Uref: x; UrefUmax: x; IrefImax: x
R80 = 300 432: R 5k6 1% 125mW 0805; Part Number: 300 432; %: 1; Imax: x; A: 0.87; Ea1: 0.16; Ea2: 0.44; Tref: 55; Pmax: 0.125; State: active; Assembly: SMD; VALUE: 5k6; Component Type: Resistor; ComponentLink1Description: Datasheet; ComponentLink1URL: \\vm-pizol\DATEN\Fabdaten\3xx xxx\30x xxx\300 xxx\300 4xx\300432_R_5K6_1%_125mW_0805; Footprint: 0805; Pin Count: 2; Published: 28.04.2016; Publisher: MFL; Signal Integrity: Resistor; Cost: 0.002000; Umax: *; Ieff: x; Ueff: x; Teff: *; SW Count: x; C1: x; C2: x; C3: x; C4: x; C5: x; Failure rate: 0.2; Uref: x; UrefUmax: x; IrefImax: x
R84 R106 = 300 070: R 47R 1% 125mW 0805; Part Number: 300 070; %: 5; Imax: x; A: 0.87; Ea1: 0.16; Ea2: 0.44; Tref: 55; Pmax: 0.125; State: active; Assembly: SMD; VALUE: 47R; LatestRevisionDate: 29.05.2018/MAG; LatestRevisionNote: From 5% to 1%; Component Type: Resistor; ComponentLink1Description: Datasheet; ComponentLink1URL: \\vm-pizol\DATEN\Fabdaten\3xx xxx\30x xxx\300 xxx\300 0xx\300070_R_47R_5%_125mW_0805; Footprint: 0805; Pin Count: 2; Published: 27.04.2016; Publisher: MFL; Signal Integrity: Resistor; Cost: 0.002000; Umax: *; Ieff: x; Ueff: x; Teff: *; SW Count: x; C1: x; C2: x; C3: x; C4: x; C5: x; Failure rate: 0.2; Uref: x; UrefUmax: x; IrefImax: x
R102 = 300 080: R 10k 1% 125mW 0805; Part Number: 300 080; %: 1; Imax: x; A: 0.87; Ea1: 0.16; Ea2: 0.44; Tref: 55; Pmax: 0.125; State: active; Assembly: SMD; VALUE: 10k; Component Type: Resistor; ComponentLink1Description: Datasheet; ComponentLink1URL: \\vm-pizol\DATEN\Fabdaten\3xx xxx\30x xxx\300 xxx\300 0xx\300080_R_10K_1%_125mW_0805; Footprint: 0805; Pin Count: 2; Published: 27.04.2016; Publisher: MFL; Signal Integrity: Resistor; Cost: 0.002000; Umax: *; Ieff: x; Ueff: x; Teff: *; SW Count: x; C1: x; C2: x; C3: x; C4: x; C5: x; Failure rate: 0.2; Uref: x; UrefUmax: x; IrefImax: x
S1 = 303 022: S Slide MSS3V 24V/25mA SPDT; Part Number: 303 022; State: active; Assembly: SMD; Value: slide; Component Type: Switch; ComponentLink1Description: Datasheet; ComponentLink1URL: \\vm-pizol\DATEN\Fabdaten\3xx xxx\30x xxx\303 xxx\303 0xx\303022; LatestRevisionDate: 09.11.2016/RKE; LatestRevisionNote: P00 166; Pin Count: 3; Published: 09.09.2016; Publisher: CVI; Signal Integrity: *; Simulation: *; Simulation Kind: *; Cost: 0.173900; Umax: *; Imax: *; Ieff: *; Ueff: *; Teff: *; SW Count: *; C1: *; C2: *; C3: *; C4: *; C5: *; A: *; Ea1: *; Ea2: *; Failure rate: *; Tref: *; Uref: *
U1 = ESP32-DEVKITC-32D: EVAL BOARD FOR ESP-WROOM-32; MF: Espressif Systems; Value: *; MP: ESP32-DEVKITC-32D; Price: None; Check_prices: https://www.snapeda.com/parts/ESP32-DEVKITC-32D/Espressif%20Systems/view-part/2777395/?ref=eda; SnapEDA_Link: https://www.snapeda.com/parts/ESP32-DEVKITC-32D/Espressif%20Systems/view-part/2777395/?ref=snap; Availability: Warning; Purchase-URL: https://pricing.snapeda.com/search/part/ESP32-DEVKITC-32D/?ref=eda; Package: None

## Assembly variants
xxx xxx x: all parts fitted